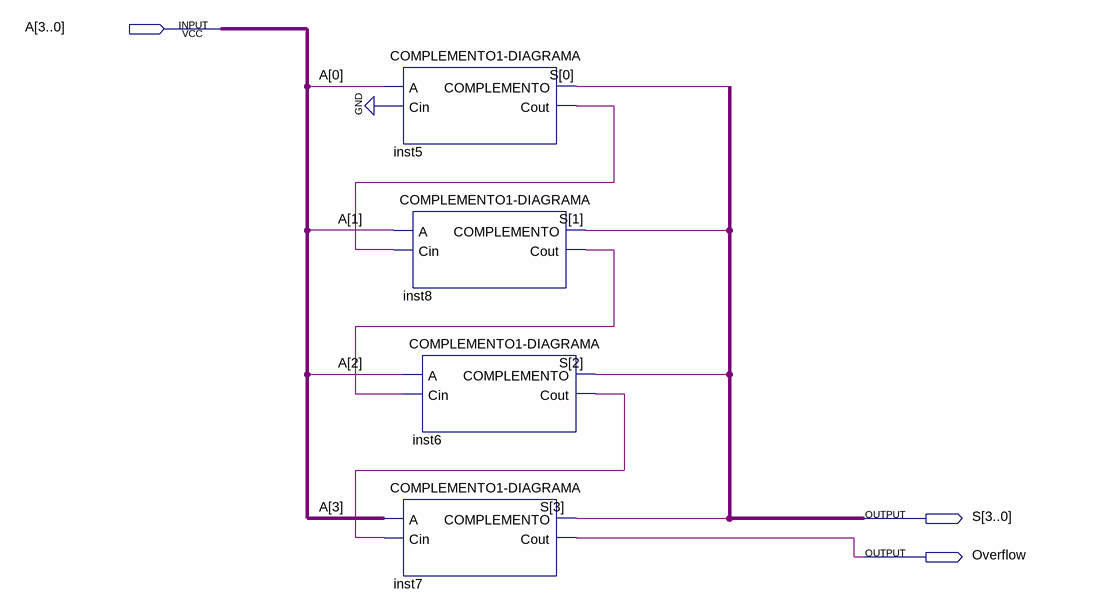
[diagram p0: schematic sheet]
// Quartus schematic COMPLEMENTO4-DIAGRAMA.bdf as structural Verilog: 4 symbols, 3 pins
module \COMPLEMENTO4-DIAGRAMA  (
  input  [3:0] A,
  output [3:0] S,
  output Overflow
);

  wire inst5_cout, inst6_cout, inst8_cout;

  \COMPLEMENTO1-DIAGRAMA  inst5 (.A(A[0]), .Cin(1'b0), .COMPLEMENTO(S[0]), .Cout(inst5_cout));
  \COMPLEMENTO1-DIAGRAMA  inst8 (.A(A[1]), .Cin(inst5_cout), .COMPLEMENTO(S[1]), .Cout(inst8_cout));
  \COMPLEMENTO1-DIAGRAMA  inst6 (.A(A[2]), .Cin(inst8_cout), .COMPLEMENTO(S[2]), .Cout(inst6_cout));
  \COMPLEMENTO1-DIAGRAMA  inst7 (.A(A[3]), .Cin(inst6_cout), .COMPLEMENTO(S[3]), .Cout(Overflow));
endmodule
